# Altium schematic sheet [3]_Connectors_&_IO.SchDoc: Connectors & IO
size A3; Author: Eladio Delgado; CompanyName: bq - Mundo Reader; Organization: bq - Mundo Reader; Revision: 0; SheetNumber: 3; SheetTotal: 5
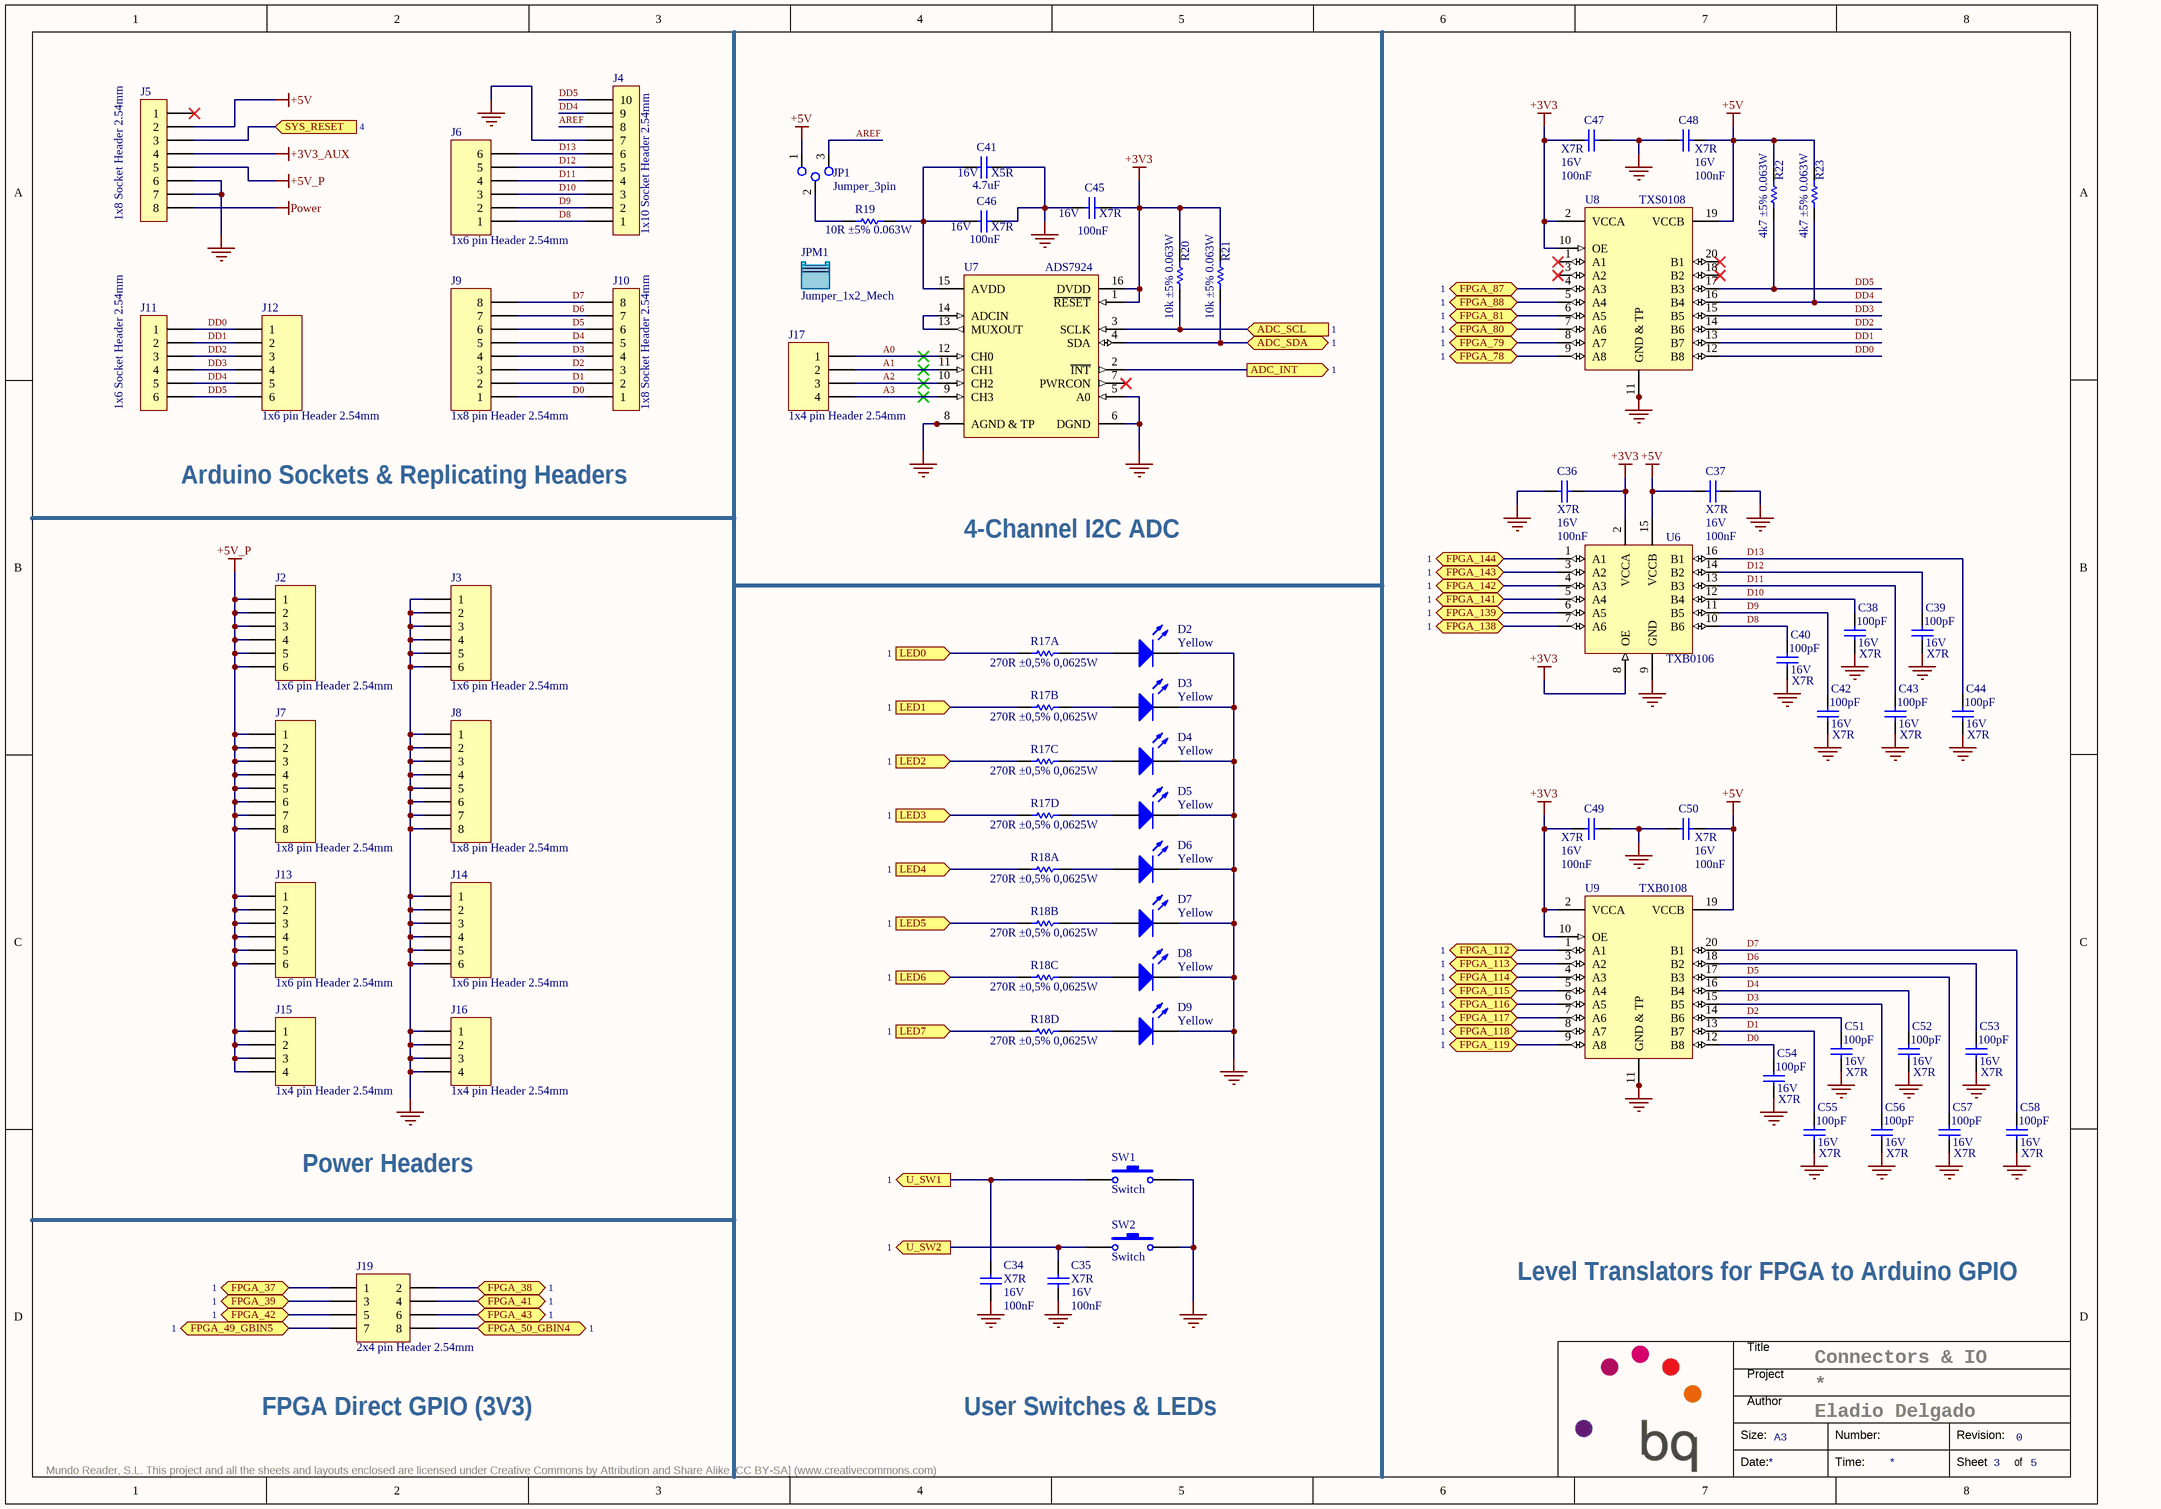
[diagram p0: [3]_Connectors_&_IO.SchDoc]

## Parts
C34  Dielectric: X7R  Voltage: 16V  Capacitance: 100nF  [C0402]  (hidden comment: Capacitor)
C35  Dielectric: X7R  Voltage: 16V  Capacitance: 100nF  [C0402]  (hidden comment: Capacitor)
C36  Dielectric: X7R  Voltage: 16V  Capacitance: 100nF  [C0402]  (hidden comment: Capacitor)
C37  Dielectric: X7R  Voltage: 16V  Capacitance: 100nF  [C0402]  (hidden comment: Capacitor)
C38  Dielectric: X7R  Voltage: 16V  Capacitance: 100pF  [C0402]  (hidden comment: Capacitor)
C39  Dielectric: X7R  Voltage: 16V  Capacitance: 100pF  [C0402]  (hidden comment: Capacitor)
C40  Dielectric: X7R  Voltage: 16V  Capacitance: 100pF  [C0402]  (hidden comment: Capacitor)
C41  Dielectric: X5R  Voltage: 16V  Capacitance: 4.7uF  [C0603]  (hidden comment: Capacitor)
C42  Dielectric: X7R  Voltage: 16V  Capacitance: 100pF  [C0402]  (hidden comment: Capacitor)
C43  Dielectric: X7R  Voltage: 16V  Capacitance: 100pF  [C0402]  (hidden comment: Capacitor)
C44  Dielectric: X7R  Voltage: 16V  Capacitance: 100pF  [C0402]  (hidden comment: Capacitor)
C45  Dielectric: X7R  Voltage: 16V  Capacitance: 100nF  [C0402]  (hidden comment: Capacitor)
C46  Dielectric: X7R  Voltage: 16V  Capacitance: 100nF  [C0402]  (hidden comment: Capacitor)
C47  Dielectric: X7R  Voltage: 16V  Capacitance: 100nF  [C0402]  (hidden comment: Capacitor)
C48  Dielectric: X7R  Voltage: 16V  Capacitance: 100nF  [C0402]  (hidden comment: Capacitor)
C49  Dielectric: X7R  Voltage: 16V  Capacitance: 100nF  [C0402]  (hidden comment: Capacitor)
C50  Dielectric: X7R  Voltage: 16V  Capacitance: 100nF  [C0402]  (hidden comment: Capacitor)
C51  Dielectric: X7R  Voltage: 16V  Capacitance: 100pF  [C0402]  (hidden comment: Capacitor)
C52  Dielectric: X7R  Voltage: 16V  Capacitance: 100pF  [C0402]  (hidden comment: Capacitor)
C53  Dielectric: X7R  Voltage: 16V  Capacitance: 100pF  [C0402]  (hidden comment: Capacitor)
C54  Dielectric: X7R  Voltage: 16V  Capacitance: 100pF  [C0402]  (hidden comment: Capacitor)
C55  Dielectric: X7R  Voltage: 16V  Capacitance: 100pF  [C0402]  (hidden comment: Capacitor)
C56  Dielectric: X7R  Voltage: 16V  Capacitance: 100pF  [C0402]  (hidden comment: Capacitor)
C57  Dielectric: X7R  Voltage: 16V  Capacitance: 100pF  [C0402]  (hidden comment: Capacitor)
C58  Dielectric: X7R  Voltage: 16V  Capacitance: 100pF  [C0402]  (hidden comment: Capacitor)
D2  Yellow  [LED0603]
D3  Yellow  [LED0603]
D4  Yellow  [LED0603]
D5  Yellow  [LED0603]
D6  Yellow  [LED0603]
D7  Yellow  [LED0603]
D8  Yellow  [LED0603]
D9  Yellow  [LED0603]
J2  1x6 pin Header 2.54mm  [1x6 Pin Header 2.54]
J3  1x6 pin Header 2.54mm  [1x6 Pin Header 2.54]
J4  1x10 Socket Header 2.54mm  [1x10 Socket Header THT 2.54mm]
J5  1x8 Socket Header 2.54mm  [1x8 Socket Header THT 2.54mm]
J6  1x6 pin Header 2.54mm  [1x6 Pin Header 2.54]
J7  1x8 pin Header 2.54mm  [1x8 Pin Header 2.54]
J8  1x8 pin Header 2.54mm  [1x8 Pin Header 2.54]
J9  1x8 pin Header 2.54mm  [1x8 Pin Header 2.54]
J10  1x8 Socket Header 2.54mm  [1x8 Socket Header THT 2.54mm]
J11  1x6 Socket Header 2.54mm  [1x6 Socket Header THT 2.54mm]
J12  1x6 pin Header 2.54mm  [1x6 Pin Header 2.54]
J13  1x6 pin Header 2.54mm  [1x6 Pin Header 2.54]
J14  1x6 pin Header 2.54mm  [1x6 Pin Header 2.54]
J15  1x4 pin Header 2.54mm  [1x4 Pin Header 2.54]
J16  1x4 pin Header 2.54mm  [1x4 Pin Header 2.54]
J17  1x4 pin Header 2.54mm  [1x4 Pin Header 2.54]
J19  2x4 pin Header 2.54mm  [2x4 Pin Header 2.54]
JP1  Jumper_3pin  [1x3 Header 2.54]
JPM1  Jumper_1x2_Mech  (mechanical)
R17  value 270R ±0,5% 0,0625W  [4xArray_1206]  (hidden comment: Resistor_x4_Parts)  (parts A,B,C,D of 4)
R18  value 270R ±0,5% 0,0625W  [4xArray_1206]  (hidden comment: Resistor_x4_Parts)  (parts A,B,C,D of 4)
R19  value 10R ±5% 0.063W  [R0402]  (hidden comment: Resistor)
R20  value 10k ±5% 0.063W  [R0402]  (hidden comment: Resistor)
R21  value 10k ±5% 0.063W  [R0402]  (hidden comment: Resistor)
R22  value 4k7 ±5% 0.063W  [R0402]  (hidden comment: Resistor)
R23  value 4k7 ±5% 0.063W  [R0402]  (hidden comment: Resistor)
SW1  Switch  [SW_SMD_6.0x3.8]
SW2  Switch  [SW_SMD_6.0x3.8]
U6  TXB0106  [QFN16]
U7  ADS7924  [QFN16]
U8  TXS0108  [VQFN20 4.5x3.5mm]
U9  TXB0108  [VQFN20 4.5x3.5mm]

## Ports
ADC_INT (out, see 1), ADC_SCL (in, see 1), ADC_SDA (bidir, see 1), FPGA_37 (bidir, see 1), FPGA_38 (bidir, see 1), FPGA_39 (bidir, see 1), FPGA_41 (bidir, see 1), FPGA_42 (bidir, see 1), FPGA_43 (bidir, see 1), FPGA_49_GBIN5 (bidir, see 1), FPGA_50_GBIN4 (bidir, see 1), FPGA_78 (bidir, see 1), FPGA_79 (bidir, see 1), FPGA_80 (bidir, see 1), FPGA_81 (bidir, see 1), FPGA_87 (bidir, see 1), FPGA_88 (bidir, see 1), FPGA_112 (bidir, see 1), FPGA_113 (bidir, see 1), FPGA_114 (bidir, see 1), FPGA_115 (bidir, see 1), FPGA_116 (bidir, see 1), FPGA_117 (bidir, see 1), FPGA_118 (bidir, see 1), FPGA_119 (bidir, see 1), FPGA_138 (bidir, see 1), FPGA_139 (bidir, see 1), FPGA_141 (bidir, see 1), FPGA_142 (bidir, see 1), FPGA_143 (bidir, see 1), FPGA_144 (bidir, see 1), LED0 (in, see 1), LED1 (in, see 1), LED2 (in, see 1), LED3 (in, see 1), LED4 (in, see 1), LED5 (in, see 1), LED6 (in, see 1), LED7 (in, see 1), SYS_RESET (in, see 4), U_SW1 (out, see 1), U_SW2 (out, see 1)

## Nets
+3V3: C36.1 C45.2 C47.2 C49.2 R20.2 R21.2 U6.2(VCCA) U6.8(OE) U7.1(~{RESET}) U7.16(DVDD) U8.2(VCCA) U8.10(OE) U9.2(VCCA) U9.10(OE)
+3V3_AUX: J5.4
+5V: C37.2 C48.1 C50.1 J5.2 JP1.1 R22.2 R23.2 U6.15(VCCB) U8.19(VCCB) U9.19(VCCB)
+5V_P: J2.1 J2.2 J2.3 J2.4 J2.5 J2.6 J5.5 J7.1 J7.2 J7.3 J7.4 J7.5 J7.6 J7.7 J7.8 J13.1 J13.2 J13.3 J13.4 J13.5 J13.6 J15.1 J15.2 J15.3 J15.4
GND: C34.1 C35.1 C36.2 C37.1 C38.1 C39.1 C40.1 C41.1 C42.1 C43.1 C44.1 C45.1 C46.2 C47.1 C48.2 C49.1 C50.2 C51.1 C52.1 C53.1 C54.1 C55.1 C56.1 C57.1 C58.1 D2.K D3.K D4.K D5.K D6.K D7.K D8.K D9.K J3.1 J3.2 J3.3 J3.4 J3.5 J3.6 J4.7 J5.6 J5.7 J8.1 J8.2 J8.3 J8.4 J8.5 J8.6 J8.7 J8.8 J14.1 J14.2 J14.3 J14.4 J14.5 J14.6 J16.1 J16.2 J16.3 J16.4 SW1.2 SW2.2 U6.9(GND) U7.0(TP) U7.5(A0) U7.6(DGND) U7.8(AGND_&_TP) U8.0(TP) U8.11(GND_&_TP) U9.0(TP) U9.11(GND_&_TP)
Power: J5.8
A0: J17.1 U7.12(CH0)
A1: J17.2 U7.11(CH1)
A2: J17.3 U7.10(CH2)
A3: J17.4 U7.9(CH3)
ADC_INT: U7.2(~{INT}) ; port ADC_INT
ADC_SCL: R20.1 U7.3(SCLK) ; port ADC_SCL
ADC_SDA: R21.1 U7.4(SDA) ; port ADC_SDA
AREF: J4.8 JP1.3
D0: C54.2 J9.1 J10.1 U9.12(B8)
D1: C55.2 J9.2 J10.2 U9.13(B7)
D2: C51.2 J9.3 J10.3 U9.14(B6)
D3: C56.2 J9.4 J10.4 U9.15(B5)
D4: C52.2 J9.5 J10.5 U9.16(B4)
D5: C57.2 J9.6 J10.6 U9.17(B3)
D6: C53.2 J9.7 J10.7 U9.18(B2)
D7: C58.2 J9.8 J10.8 U9.20(B1)
D8: C40.2 J4.1 J6.1 U6.10(B6)
D9: C42.2 J4.2 J6.2 U6.11(B5)
D10: C38.2 J4.3 J6.3 U6.12(B4)
D11: C43.2 J4.4 J6.4 U6.13(B3)
D12: C39.2 J4.5 J6.5 U6.14(B2)
D13: C44.2 J4.6 J6.6 U6.16(B1)
DD0: J11.1 J12.1 U8.12(B8)
DD1: J11.2 J12.2 U8.13(B7)
DD2: J11.3 J12.3 U8.14(B6)
DD3: J11.4 J12.4 U8.15(B5)
DD4: J4.9 J11.5 J12.5 R23.1 U8.16(B4)
DD5: J4.10 J11.6 J12.6 R22.1 U8.17(B3)
FPGA_37: J19.1 ; port FPGA_37
FPGA_38: J19.2 ; port FPGA_38
FPGA_39: J19.3 ; port FPGA_39
FPGA_41: J19.4 ; port FPGA_41
FPGA_42: J19.5 ; port FPGA_42
FPGA_43: J19.6 ; port FPGA_43
FPGA_49_GBIN5: J19.7 ; port FPGA_49_GBIN5
FPGA_50_GBIN4: J19.8 ; port FPGA_50_GBIN4
FPGA_78: U8.9(A8) ; port FPGA_78
FPGA_79: U8.8(A7) ; port FPGA_79
FPGA_80: U8.7(A6) ; port FPGA_80
FPGA_81: U8.6(A5) ; port FPGA_81
FPGA_87: U8.4(A3) ; port FPGA_87
FPGA_88: U8.5(A4) ; port FPGA_88
FPGA_112: U9.1(A1) ; port FPGA_112
FPGA_113: U9.3(A2) ; port FPGA_113
FPGA_114: U9.4(A3) ; port FPGA_114
FPGA_115: U9.5(A4) ; port FPGA_115
FPGA_116: U9.6(A5) ; port FPGA_116
FPGA_117: U9.7(A6) ; port FPGA_117
FPGA_118: U9.8(A7) ; port FPGA_118
FPGA_119: U9.9(A8) ; port FPGA_119
FPGA_138: U6.7(A6) ; port FPGA_138
FPGA_139: U6.6(A5) ; port FPGA_139
FPGA_141: U6.5(A4) ; port FPGA_141
FPGA_142: U6.4(A3) ; port FPGA_142
FPGA_143: U6.3(A2) ; port FPGA_143
FPGA_144: U6.1(A1) ; port FPGA_144
LED0: R17.1 ; port LED0
LED1: R17.2 ; port LED1
LED2: R17.3 ; port LED2
LED3: R17.4 ; port LED3
LED4: R18.1 ; port LED4
LED5: R18.2 ; port LED5
LED6: R18.3 ; port LED6
LED7: R18.4 ; port LED7
SYS_RESET: J5.3 ; port SYS_RESET
U_SW1: C34.2 SW1.1 ; port U_SW1
U_SW2: C35.2 SW2.1 ; port U_SW2
NetC41_2: C41.2 C46.1 R19.2 U7.15(AVDD)
NetD2_A: D2.A R17.8
NetD3_A: D3.A R17.7
NetD4_A: D4.A R17.6
NetD5_A: D5.A R17.5
NetD6_A: D6.A R18.8
NetD7_A: D7.A R18.7
NetD8_A: D8.A R18.6
NetD9_A: D9.A R18.5
NetJP1_2: JP1.2 R19.1
NetU7_13: U7.13(MUXOUT) U7.14(ADCIN)

Not connected (* = marked no-connect by the designer): J5 1*; U7 7(PWRCON)*; U8 1(A1)* 3(A2)* 18(B2)* 20(B1)*

## Notes on the sheet
- Arduino Sockets & Replicating Headers
- 4-Channel I2C ADC
- Power Headers
- Level Translators for FPGA to Arduino GPIO
- FPGA Direct GPIO (3V3)
- User Switches & LEDs
- Title
- Project
- Size:
- Author
- A3
- Number:
- Revision:
- Mundo Reader, S.L. This project and all the sheets and layouts enclosed are licensed under Creative Commons by Attribution and Share Alike [CC BY-SA] (www.creativecommons.com)
- Date:
- Time:
- Sheet
- of

## Library data of the parts
C34-C37 C45-C50 = C0402_100nF_16V_±10%: Capacitor SMD; Manufacturer: Kemet; Value: 100nF ±10% 16V; Tolerance: ±10%; OrderingCode: C0402C104K4RAC; Temp_ Max: 125; Temp_ Min: -55; Part Number: C0402_100nF_16V_±10%; Price (€): 0,05
C38-C40 C42-C44 C51-C58 = C0402_100pF_16V_±10%: Capacitor SMD; Manufacturer: Kemet; Value: 100pF ±10% 16V; Tolerance: ±10%; OrderingCode: C0402C101K4RAC; Temp_ Max: 125; Temp_ Min: -55; Part Number: C0402_100pF_16V_±10%; Price (€): 0,036
C41 = C0603_4.7uF_16V_±10%: Capacitor SMD; Manufacturer: TDK; Value: 4.7uF ±10% 16V; Tolerance: ±10%; OrderingCode: C1608X5R1C475K080AC; Temp_ Max: 85; Temp_ Min: -55; Part Number: C0603_4.7uF_16V_±10%; Price (€): 0,068
D2-D9 = LY Q971-H1L2-36: LED; Manufacturer: OSRAM Opto; Temp_ Max: 85; Temp_ Min: -40; OrderingCode 2: HSMY-C190; Part Number: LY Q971-H1L2-36; OrderingCode: LY Q971-H1L2-36; Price (€): 0,028; Manufacturer 2: Avago Technologies; Value: Yellow
J2 J13 = CON_PH_THT2.54_6 Red: Manufacturer: Samtec; OrderingCode: TSW-106-07-T-S-RED; Temp_ Max: 125; Temp_ Min: -40; Pitch: 2.54mm; Part Number: CON_PH_THT2.54_6 Red; Supplier: Samtec; Price (€): 0,26
J3 J14 = CON_PH_THT2.54_6: Manufacturer: Samtec; OrderingCode: TSW-106-07-T-S; Temp_ Max: 125; Temp_ Min: -40; Value: 6; OrderingCode 2: 613 006 111 21; Pitch: 2.54mm; Part Number: CON_PH_THT2.54_6; Supplier: Samtec; Price (€): 0,26; Manufacturer 2: Würth Elektronik
J4 = CON_SH_THT2.54_10: Connector, 10 pin Socket Header 2.54mm; Manufacturer: Samtec; OrderingCode: SSW-110-01-T-S; Temp_ Max: 125; Temp_ Min: -40; OrderingCode 2: 613 010 118 21; Value: 10; Pitch: 2.54mm; Part Number: CON_SH_THT2.54_10; Supplier: Samtec; Price (€): 0,578; Manufacturer 2: Würth Elektronik
J5 J10 = CON_SH_THT2.54_8: 8 pin Socket Header 2.54mm; Manufacturer: Samtec; OrderingCode: SSW-108-01-T-S; Temp_ Max: 125; Temp_ Min: -40; Value: 8; OrderingCode 2: 613 008 118 21; Pitch: 2.54mm; Part Number: CON_SH_THT2.54_8; Supplier: Samtec; Price (€): 0,438; Manufacturer 2: Würth Elektronik
J6 = CON_PH_THT2.54_6 Natural: Manufacturer: Samtec; OrderingCode: TSW-106-07-T-S-NATURAL; Temp_ Max: 125; Temp_ Min: -40; Pitch: 2.54mm; Part Number: CON_PH_THT2.54_6 Natural; Supplier: Samtec; Price (€): 0,26
J7 = CON_PH_THT2.54_8 Red: Manufacturer: Samtec; OrderingCode: TSW-108-07-T-S-RED; Temp_ Max: 125; Temp_ Min: -40; Pitch: 2.54mm; Part Number: CON_PH_THT2.54_8 Red; Supplier: Samtec; Price (€): 0,35
J8 = CON_PH_THT2.54_8: Manufacturer: Samtec; OrderingCode: TSW-108-07-T-S; Temp_ Max: 125; Temp_ Min: -40; Value: 8; OrderingCode 2: 613 008 111 21; Pitch: 2.54mm; Part Number: CON_PH_THT2.54_8; Supplier: Samtec; Price (€): 0,35; Manufacturer 2: Würth Elektronik
J9 = CON_PH_THT2.54_8 Natural: Manufacturer: Samtec; OrderingCode: TSW-108-07-T-S-NATURAL; Temp_ Max: 125; Temp_ Min: -40; Pitch: 2.54mm; Part Number: CON_PH_THT2.54_8 Natural; Supplier: Samtec; Price (€): 0,35
J11 = CON_SH_THT2.54_6: 6 pin Socket Header 2.54mm; Manufacturer: Samtec; OrderingCode: SSW-106-01-T-S; Temp_ Max: 125; Temp_ Min: -40; Value: 6; OrderingCode 2: 613 006 118 21; Pitch: 2.54mm; Part Number: CON_SH_THT2.54_6; Supplier: Samtec; Price (€): 0,381; Manufacturer 2: Würth Elektronik
J12 = CON_PH_THT2.54_6 Natural: Connector, 1x6 pin Header 2.54mm; Manufacturer: Samtec; OrderingCode: TSW-106-07-T-S-NATURAL; Temp_ Max: 105; Temp_ Min: -55; Pitch: 2.54mm; Part Number: CON_PH_THT2.54_6 Natural; Supplier: Samtec; Price (€): 0,26
J15 = CON_PH_THT2.54_4 Red: Connector, 1x4 pin Header 2.54mm; Manufacturer: Samtec; OrderingCode: TSW-104-07-T-S-RED; Temp_ Max: 105; Temp_ Min: -55; Pitch: 2.54mm; Part Number: CON_PH_THT2.54_4 Red; Supplier: Samtec; Price (€): 0,23
J16 = CON_PH_THT2.54_4: Connector, 1x4 pin Header 2.54mm; Manufacturer: Samtec; OrderingCode: TSW-104-07-T-S; Temp_ Max: 105; Temp_ Min: -55; OrderingCode 2: 613 004 111 21; Value: 4; Pitch: 2.54mm; Part Number: CON_PH_THT2.54_4; Supplier: Samtec; Price (€): 0,211; Manufacturer 2: Würth Elektronik
J17 = CON_PH_THT2.54_4: Connector, 1x4 pin Header 2.54mm; Manufacturer: Samtec; Part Number: CON_PH_THT2.54_4 Blue; OrderingCode: TSW-104-07-T-S-BLUE; Temp_ Max: 105; Temp_ Min: -55; OrderingCode 2: 613 004 111 21; Value: 4; Pitch: 2.54mm; Supplier: Samtec; Price (€): 0,211; Manufacturer 2: Würth Elektronik
J19 = CON_DPH_THT2.54_8: Connector, 8 pin Dual Header 2.54mm; Manufacturer: Samtec; OrderingCode: TSW-104-07-T-D; Temp_ Max: 125; Temp_ Min: -40; OrderingCode 2: 613 008 211 21; Value: 8; Pitch: 2.54mm; Part Number: CON_DPH_THT2.54_8; Supplier: Samtec; Price (€): 0,305; Manufacturer 2: Würth Elektronik
JP1 = Jumper_3pin_THT: Connector, Jumper, 3 pin Male Header 2.54mm; Manufacturer: Würth; OrderingCode: 613 003 111 21 / 609 002 136 21; Temp_ Max: 125; Temp_ Min: -40; Value: 3; Part Number: Jumper_3pin_THT; Supplier: Würth
JPM1 = Jumper_2pin_Mech: Connector, Jumper, 1x2 Jumper 2.54mm; Manufacturer: Würth; OrderingCode: 609 002 136 21; Temp_ Max: 125; Temp_ Min: -40; Value: Blue 1x2; Part Number: Jumper_2pin_Mech; Supplier: Würth; Price (€): 0,05
R17 R18 = 4xArray_1206_270R_0,0625W_±0,5%: Resistor; Manufacturer: Bourns; Tolerance: ±0,5%; OrderingCode: CAY16-271J4LF; Resistance: 270R; Temp_ Max: 125; Temp_ Min: -55; PackageDescription: SMD; Power: 0,0625W; Part Number: 4xArray_1206_270R_0,0625W_±0,5%; Price (€): 0,03
R19 = R0402_10R_0.063W_±5%: Resistor, SMD; Manufacturer: Vishay; Tolerance: ±5%; OrderingCode: CRCW040210R0JN; Power: 0.063W; Resistance: 10R; Temp_ Max: 155; Temp_ Min: -55; PackageDescription: SMD; Part Number: R0402_10R_0.063W_±5%; Price (€): 0,003
R20 R21 = R0402_10k_0.063W_±5%: Resistor, SMD; Manufacturer: Vishay; Tolerance: ±5%; OrderingCode: CRCW040210K0JN; Power: 0.063W; Resistance: 10k; Temp_ Max: 155; Temp_ Min: -55; PackageDescription: SMD; Part Number: R0402_10k_0.063W_±5%; Price (€): 0,003
R22 R23 = R0402_4k7_0.063W_±5%: Resistor, SMD; Manufacturer: Vishay; Tolerance: ±5%; OrderingCode: CRCW04024K70JN; Power: 0.063W; Resistance: 4k7; Temp_ Max: 155; Temp_ Min: -55; PackageDescription: SMD; Part Number: R0402_4k7_0.063W_±5%; Price (€): 0,003
SW1 SW2 = SW SMD: Micro miniature pushbutton surface Switch; Part Number: SW SMD; Manufacturer: Würth Elektronik; OrderingCode: 434 121 025 816; Temp_ Max: 85; Temp_ Min: -40; OrderingCode 2: KSR231GLFS; Supplier: Würth; Price (€): 0,223; Manufacturer 2: Cannon, ITT Industries
U6 = TXB0106: Voltage Translator, Hex; Manufacturer: Texas Instruments; OrderingCode: TXB0106RGYR; Temp_ Max: 85; Temp_ Min: -40; Part Number: TXB0106; Supplier: Silica; Price (€): 0,7
U7 = ADS7924: ADC Converter, 12-Bit, 4-Ch, I2C; Manufacturer: Texas Instruments; OrderingCode: ADS7924IRTER; Temp_ Max: 85; Temp_ Min: -40; Part Number: ADS7924; Supplier: Silica; Price (€): 1,35
U8 = TXS0108: Voltage Level Translator, 8-Bit Bidir., with TP; Manufacturer: Texas Instruments; OrderingCode: TXS0108ERGYR; Temp_ Max: 85; Temp_ Min: -40; Part Number: TXS0108; Supplier: Silica; Price (€): 0,832
U9 = TXB0108: Voltage Level Translator, 8-Bit Bidir., with TP; Manufacturer: Texas Instruments; OrderingCode: TXB0108RGYR; Temp_ Max: 85; Temp_ Min: -40; Part Number: TXB0108; Supplier: Silica; Price (€): 0,832